# EAGLE design NodeLCD.v1 (EAGLE 4.13)
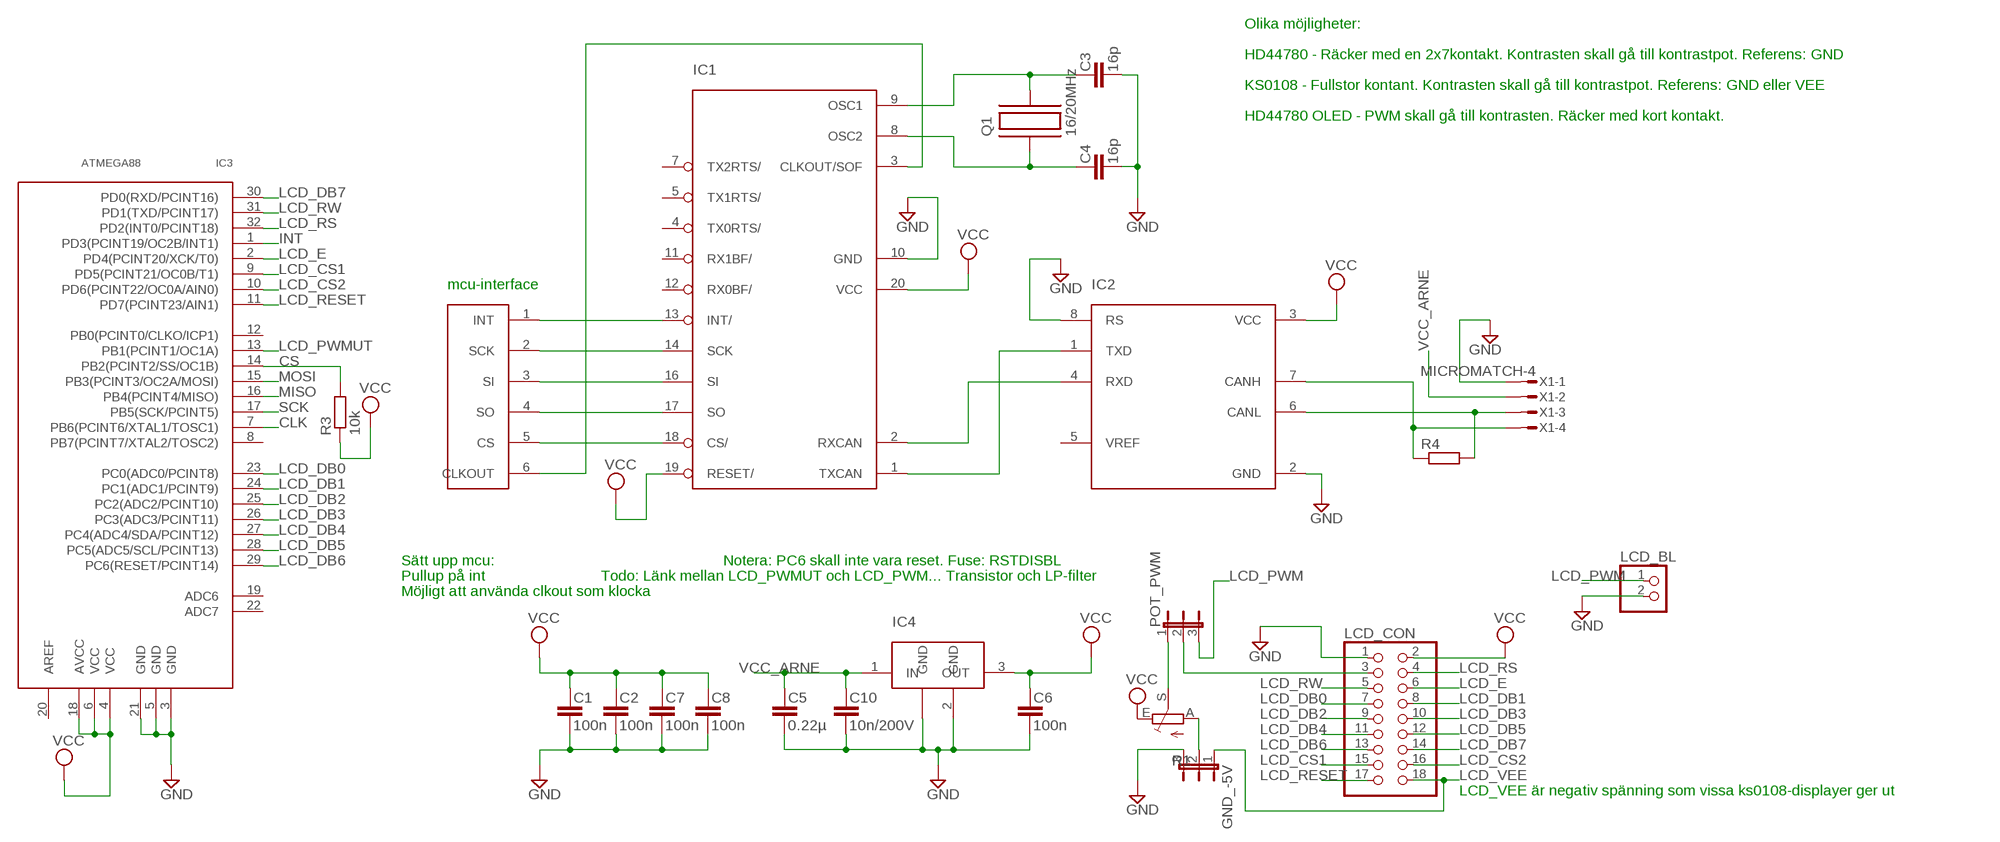
[diagram p0: schematic, sheet 1]

## Parts
C1  100n  C-EU  [C0603]
C2  100n  C-EU  [C0603]
C3  16p  C-EU  [C0603]
C4  16p  C-EU  [C0603]
C5  0.22µ  C-EU  [C0603]
C6  100n  C-EU  [C0603]
C7  100n  C-EU  [C0603]
C8  100n  C-EU  [C0603]
C10  10n/200V  C-EU  [C0603]
GND_-5V  JP2E  [JP2]
IC1  MCP2515  [TSSOP]
IC2  MCP2551  [SOIC]
IC3  ATMEGA88  [TQFP32]
IC4  LM340MP-5.0  [SOT223]
LCD_BL  PINHD-1X2  [1X02]
LCD_CON  PINHD-2X9  [2X09]
POT_PWM  JP2E  [JP2]
Q1  16/20MHz  C-MAC-LFA147E  [SMD]
R1  TRIM_EU-CA9H  [CA9H]
R3  10k  R-EUR0603  [R0603]
R4  R-EUR0603  [R0603]
U$1  CAN-INTERFACE  [VIA-LIST]
X1  MICROMATCH-4  [MICROMATCH-4]

## Nets
CANH: IC2.7(CANH) R4.1 X1.4
CANL: IC2.6(CANL) R4.2 X1.3
CLK: IC1.3(CLKOUT/SOF) IC3.7(PB6(PCINT6/XTAL1/TOSC1)) U$1.6(CLKOUT)
CS: IC1.18(CS/) IC3.14(PB2(PCINT2/SS/OC1B)) R3.2 U$1.5(CS)
GND: C1.2 C2.2 C3.2 C4.2 C5.2 C6.2 C7.2 C8.2 C10.2 GND_-5V.3 IC1.10(GND) IC2.2(GND) IC2.8(RS) IC3.3(GND) IC3.5(GND) IC3.21(GND) IC4.2(GND) IC4.4(GND) LCD_BL.2 LCD_CON.1 X1.1
INT: IC1.13(INT/) IC3.1(PD3(PCINT19/OC2B/INT1)) U$1.1(INT)
LCD_CS1: IC3.9(PD5(PCINT21/OC0B/T1)) LCD_CON.15
LCD_CS2: IC3.10(PD6(PCINT22/OC0A/AIN0)) LCD_CON.16
LCD_DB0: IC3.23(PC0(ADC0/PCINT8)) LCD_CON.7
LCD_DB1: IC3.24(PC1(ADC1/PCINT9)) LCD_CON.8
LCD_DB2: IC3.25(PC2(ADC2/PCINT10)) LCD_CON.9
LCD_DB3: IC3.26(PC3(ADC3/PCINT11)) LCD_CON.10
LCD_DB4: IC3.27(PC4(ADC4/SDA/PCINT12)) LCD_CON.11
LCD_DB5: IC3.28(PC5(ADC5/SCL/PCINT13)) LCD_CON.12
LCD_DB6: IC3.29(PC6(RESET/PCINT14)) LCD_CON.13
LCD_DB7: IC3.30(PD0(RXD/PCINT16)) LCD_CON.14
LCD_E: IC3.2(PD4(PCINT20/XCK/T0)) LCD_CON.6
LCD_PWM: LCD_BL.1 POT_PWM.3
LCD_PWMUT: IC3.13(PB1(PCINT1/OC1A))
LCD_RESET: IC3.11(PD7(PCINT23/AIN1)) LCD_CON.17
LCD_RS: IC3.32(PD2(INT0/PCINT18)) LCD_CON.4
LCD_RW: IC3.31(PD1(TXD/PCINT17)) LCD_CON.5
LCD_VEE: GND_-5V.1 LCD_CON.18
MISO: IC1.17(SO) IC3.16(PB4(PCINT4/MISO)) U$1.4(SO)
MOSI: IC1.16(SI) IC3.15(PB3(PCINT3/OC2A/MOSI)) U$1.3(SI)
N$1: IC1.2(RXCAN) IC2.4(RXD)
N$2: IC1.1(TXCAN) IC2.1(TXD)
N$3: POT_PWM.1 R1.S
N$4: GND_-5V.2 R1.A
N$5: LCD_CON.3 POT_PWM.2
N$12: C3.1 IC1.9(OSC1) Q1.P$2
N$13: C4.1 IC1.8(OSC2) Q1.P$1
SCK: IC1.14(SCK) IC3.17(PB5(SCK/PCINT5)) U$1.2(SCK)
VCC: C1.1 C2.1 C6.1 C7.1 C8.1 IC1.19(RESET/) IC1.20(VCC) IC2.3(VCC) IC3.4(VCC) IC3.6(VCC) IC3.18(AVCC) IC4.3(OUT) LCD_CON.2 R1.E R3.1
VCC_ARNE: C5.1 C10.1 IC4.1(IN) X1.2
Unconnected: IC1.4(TX0RTS/) IC1.5(TX1RTS/) IC1.7(TX2RTS/) IC1.11(RX1BF/) IC1.12(RX0BF/) IC2.5(VREF) IC3.8(PB7(PCINT7/XTAL2/TOSC2)) IC3.12(PB0(PCINT0/CLKO/ICP1)) IC3.19(ADC6) IC3.20(AREF) IC3.22(ADC7)

## Notes on the sheet
- Olika möjligheter:
- HD44780 - Räcker med en 2x7kontakt. Kontrasten skall gå till kontrastpot. Referens: GND
- KS0108 - Fullstor kontant. Kontrasten skall gå till kontrastpot. Referens: GND eller VEE
- HD44780 OLED - PWM skall gå till kontrasten. Räcker med kort kontakt.
- mcu-interface
- Sätt upp mcu: | Notera: PC6 skall inte vara reset. Fuse: RSTDISBL
- Pullup på int | Todo: Länk mellan LCD_PWMUT och LCD_PWM... Transistor och LP-filter
- Möjligt att använda clkout som klocka
- LCD_VEE är negativ spänning som vissa ks0108-displayer ger ut

## Library data of the parts
C1-C8 C10 = rcl:C-EU
GND_-5V POT_PWM = jumper:JP2E: JUMPER
IC1 = mcp2515:MCP2515
IC2 = mcp2551:MCP2551
IC3 = atmega88:ATMEGA88
IC4 = lm340mp:LM340MP-5.0
LCD_BL = pinhead:PINHD-1X2: PIN HEADER
LCD_CON = pinhead:PINHD-2X9: PIN HEADER
Q1 = hc49-4h-smx:C-MAC-LFA147E
R1 = pot:TRIM_EU-: POTENTIOMETER
R3 R4 = rcl:R-EU
U$1 = can-interface:CAN-INTERFACE
X1 = con-amp-micromatch:MICROMATCH-4: MicroMaTch 4 7-215464-4 / 0-215464-4 Drawing Number C-215464 DDEController.pdf

## Board
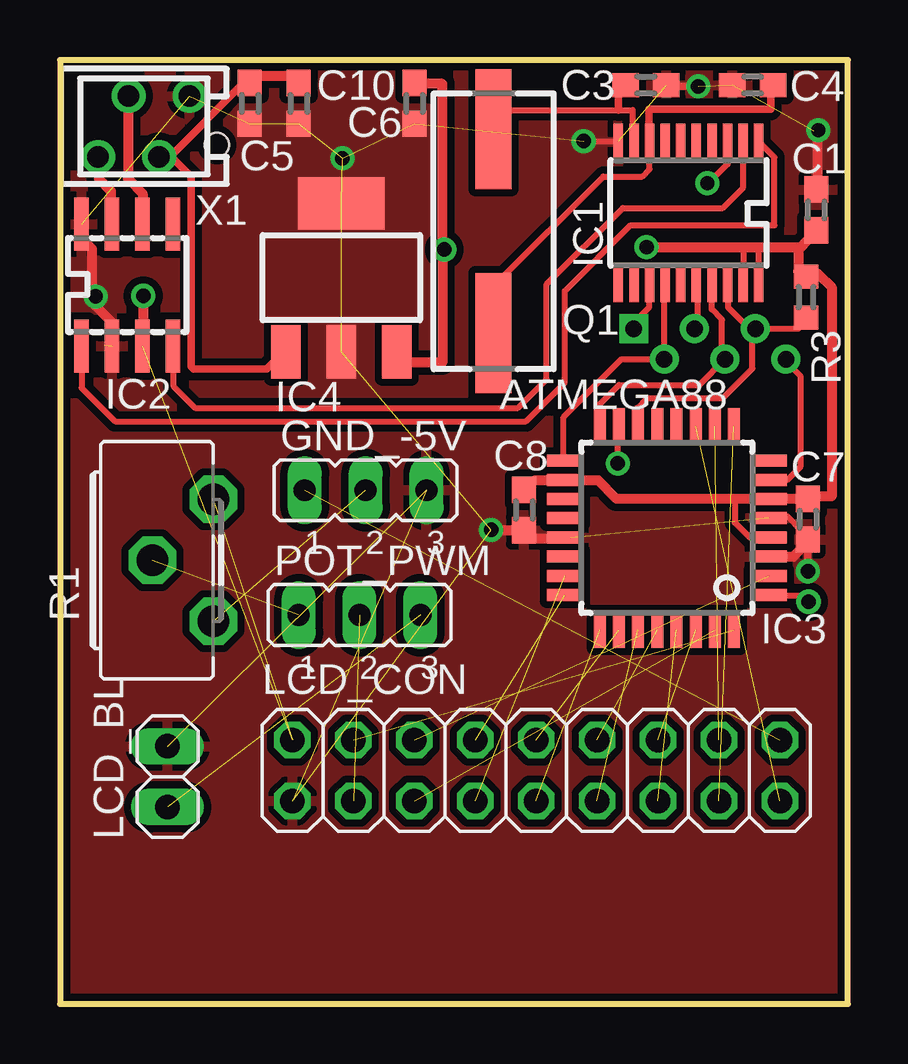
[diagram p1: board, top side]
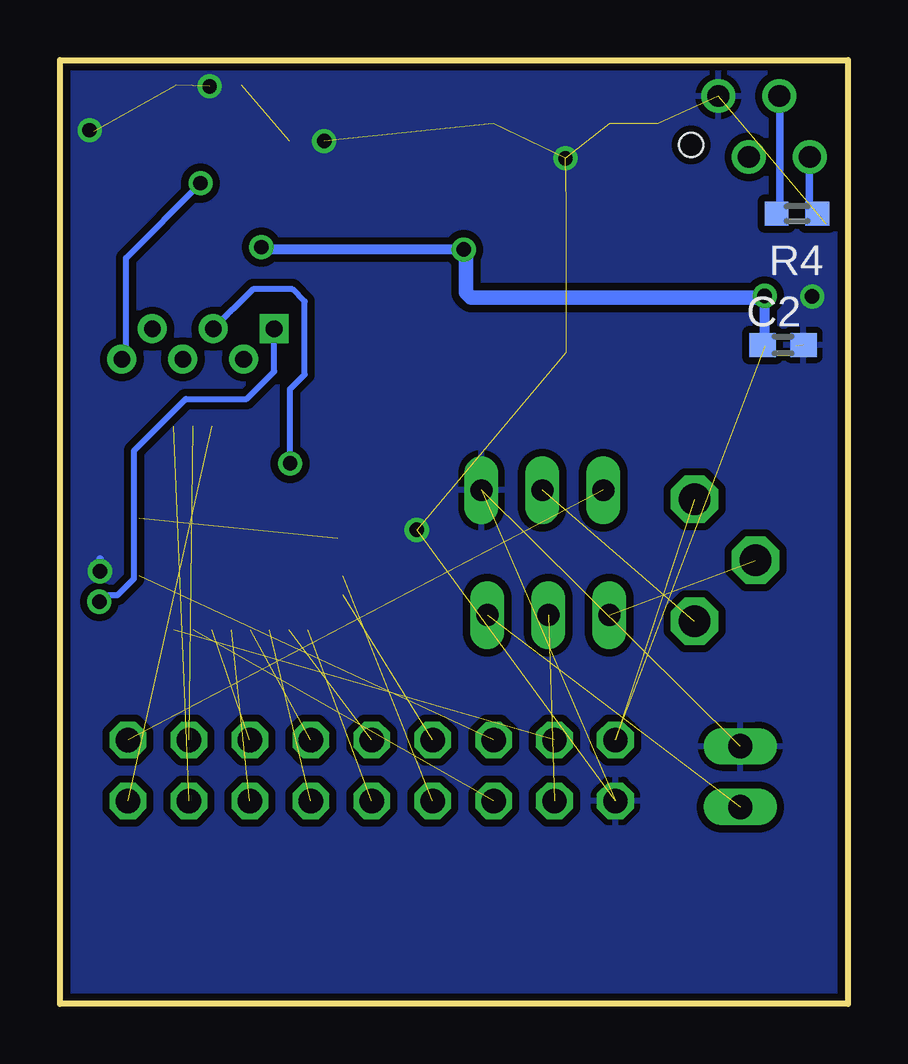
[diagram p2: board, bottom side, seen from below]

Size 32.85 x 39.35 mm. Coordinates in mm from the lower left corner, seen from the top.
Outline: 0,0 32.85,0 32.85,39.35 0,39.35 0,0
Copper layers (1*16): Top 0.035mm / dielectric 1.5mm / Bottom 0.035mm
Design rules "10mils, 0.6drill": minimum track width 10mil, minimum drill 0.6mm, track to track 10mil, track to pad 10mil, pad to pad 10mil, via to via 10mil, smd to smd 10mil, copper to edge 10mil, drill to drill 10mil, minimum pad ring 10mil, minimum via ring 8mil, stop-mask expansion 0mil, vias tented up to drill 0mil, thermal gap 10mil

### Footprints (pad centres in the part's own frame; a part is rotated, then mirrored left to right if it is on the bottom)
C0603 = smd 1.1 x 1: 1 -0.85,0; 2 0.85,0
JP2 = drill 0.914 long: 1 -2.54,0; 2 0,0; 3 2.54,0
TSSOP = smd 0.396 x 1.5: 1 -2.925,-2.975; 2 -2.275,-2.975; 3 -1.625,-2.975; 4 -0.975,-2.975; 5 -0.325,-2.975; 6 0.325,-2.975; 7 0.975,-2.975; 8 1.625,-2.975; 9 2.275,-2.975; 10 2.925,-2.975; 11 2.925,2.975; 12 2.275,2.975; 13 1.625,2.975; 14 0.975,2.975; 15 0.325,2.975; 16 -0.325,2.975; 17 -0.975,2.975; 18 -1.625,2.975; 19 -2.275,2.975; 20 -2.925,2.975
SOIC = smd 0.6 x 2.2: 1 -1.905,-2.54; 2 -0.635,-2.54; 3 0.635,-2.54; 4 1.905,-2.54; 5 1.905,2.54; 6 0.635,2.54; 7 -0.635,2.54; 8 -1.905,2.54
TQFP32 = smd 1.5 x 0.5: 1 -4.25,2.65; 2 -4.25,1.85; 3 -4.25,1.05; 4 -4.25,0.25; 5 -4.25,-0.55; 6 -4.25,-1.35; 7 -4.25,-2.15; 8 -4.25,-2.95; 17 4.25,-2.95; 18 4.25,-2.15; 19 4.25,-1.35; 20 4.25,-0.55; 21 4.25,0.25; 22 4.25,1.05; 23 4.25,1.85; 24 4.25,2.65 | smd 0.5 x 1.5: 9 -2.8,-4.4; 10 -2,-4.4; 11 -1.2,-4.4; 12 -0.4,-4.4; 13 0.4,-4.4; 14 1.2,-4.4; 15 2,-4.4; 16 2.8,-4.4; 25 2.8,4.1; 26 2,4.1; 27 1.2,4.1; 28 0.4,4.1; 29 -0.4,4.1; 30 -1.2,4.1; 31 -2,4.1; 32 -2.8,4.1
SOT223 = smd 1.219 x 2.235: 1 -2.311,-3.099; 2 0,-3.099; 3 2.311,-3.099 | smd 3.6 x 2.2: 4 0,3.099
1X02 = drill 1.016 long: 1 -1.27,0; 2 1.27,0
2X09 = drill 1.016 octagon: 1 -10.16,-1.27; 2 -10.16,1.27; 3 -7.62,-1.27; 4 -7.62,1.27; 5 -5.08,-1.27; 6 -5.08,1.27; 7 -2.54,-1.27; 8 -2.54,1.27; 9 0,-1.27; 10 0,1.27; 11 2.54,-1.27; 12 2.54,1.27; 13 5.08,-1.27; 14 5.08,1.27; 15 7.62,-1.27; 16 7.62,1.27; 17 10.16,-1.27; 18 10.16,1.27
SMD = smd 5 x 1.5: P$1 4.25,0; P$2 -4.25,0
CA9H = drill 1.321 octagon: A -2.54,0; E 2.54,0; S 0,2.54
R0603 = smd 0.991 x 1.016: 1 -0.85,0; 2 0.85,0
VIA-LIST = drill 0.7 square: 1 0,2.54 | drill 0.7 round: 2 -1.27,1.27; 3 0,0; 4 -1.27,-1.27; 5 0,-2.54; 6 -1.27,-3.81
MICROMATCH-4 = drill 0.9 round: 1 1.905,1.27; 2 0.635,-1.27; 3 -0.635,1.27; 4 -1.905,-1.27 | hole 1: 3.048,-0.762

### Placement (x,y rotation side)
C1  31.54,33.1 90 top
C2  2.7,27.47 0 bottom
C3  24.43,38.3 0 top
C4  28.87,38.3 180 top
C5  7.92,37.54 270 top
C6  14.77,37.54 270 top
C7  31.17,20.21 270 top
C8  19.34,20.59 270 top
C10  9.95,37.54 270 top
GND_-5V  12.74,21.41 0 top
IC1  26.21,32.97 180 top
IC2  2.8,29.97 0 top
IC3  25.3,19.7 180 top
IC4  11.73,30.27 0 top
LCD_BL  4.49,9.47 90 top
LCD_CON  19.85,9.73 0 top
POT_PWM  12.49,16.21 0 top
Q1  18.08,32.21 270 top
R1  6.39,18.49 90 top
R3  31.11,29.46 270 top
R4  2.12,32.94 180 bottom
U$1  26.46,28.14 90 top
X1  3.5,36.58 0 top

### Tracks (layer width: path | path; a pad name or v marks a point on that pad's centre or on a via)
CANH
  Top 0.305: 2.12,32.55 IC2.7 | X1.4 1.62,35.31
  Top 0.406: 2.12,32.55 2.12,33.88 1.62,34.39 1.62,35.31
  Bottom 0.305: X1.4 1.62,35.31 1.62,33.29 R4.1
CANL
  Top 0.305: IC2.6 | X1.3 2.84,37.85
  Top 0.406: IC2.6 3.45,33.78 2.84,34.39 2.84,37.85
  Bottom 0.305: X1.3 2.84,37.85 2.84,33.08 R4.2
CLK  (via drill 0.6)
  Top 0.254: IC1.3 27.83,35.84 27.83,35 27.02,34.19 v26.99,34.22 | IC3.7 30.32,21.85 30.88,22.4 30.88,26.16 30.22,26.82 30.17,26.87
  Top 0.406: 30.17,26.77 30.22,26.82 U$1.6
  Bottom 0.254: v26.99,34.22 30.09,31.09 30.09,27.03 U$1.6
CS
  Top 0.254: IC1.18 27.83,30.12 27.86,30.12 27.86,29.03 28.87,28.02 | IC3.14 24.07,24.23 | 24.07,24.23 24.07,24.25 | 28.87,28.02 28.87,26.49 27.63,25.25 24.48,25.25 24.07,24.84 24.07,24.44 24.17,23.72 24.07,24.23 | 28.87,28.02 U$1.5 30.78,28.14 31.03,28.4 31.03,28.6 30.97,28.6 R3.2
GND  (via drill 0.6)  (17 unrouted)
  Top 0.254: v21.84,35.97 23.28,35.97 IC1.10 | C1.2 31.59,34.27 | 1.34,29.24 v1.49,29.49 | 20.56,19.41 IC3.21 21.28,19.43 | C8.2 19.8,19.41 | C7.2 31.11,19.69 30.93,19.69 30.32,20.32 29.76,20.27 29.74,20.25 IC3.5 | v31.61,36.42 31.44,36.37 31.59,36.22
  Top 0.305: IC2.2 2.2,27.76 | C3.2 25.45,38.25 v26.61,38.25 | 30.93,19.69 31.16,19.69 31.18,19.66 31.18,19.15 v31.18,18.04
  Top 0.406: 2.2,27.76 2.2,28.37 1.34,29.24 1.34,31.47 0.83,31.98 IC2.8 | 19.8,19.41 20.56,19.41 | 31.59,34.27 31.59,36.22 | 31.18,19.15 31.08,19.15 30.58,18.65 IC3.3 | C8.2 18,19.74 v17.97,19.76
  Bottom 0.305: v26.61,38.25 26.56,38.33 | v31.18,18.04 31.18,18.54
  Bottom 0.406: v17.97,19.76 18.08,19.76
  other vias: 11.78,35.25
  pour Bottom (isolate 0.305): 0.12,39.24 32.83,39.24 32.83,0.1 24.38,0.1 0.12,0.1
  pour Top (isolate 0.305, no thermals): 5.83,38.88 15.89,38.88 15.89,25.16 5.83,25.16
  pour Top (isolate 0.305): 0.17,39.19 32.68,39.19 32.68,0.08 0.17,0.08
INT  (via drill 0.6)
  Top 0.254: IC1.13 | IC1.13 | U$1.1 23.92,28.4 24.55,29.03 24.55,29.97 IC1.13 | IC3.1 29.48,17.05 29.46,17.02 30.01,17.07 30.07,17.02 30.95,17.02 v31.21,16.77
  Bottom 0.254: v31.21,16.77 30.9,17.04 30.45,17.04 29.76,17.73 29.76,23.06 27.6,25.22 25.06,25.22 23.92,26.37 U$1.1
LCD_CS1  (1 unrouted)
LCD_CS2  (1 unrouted)
LCD_DB0  (1 unrouted)
LCD_DB1  (1 unrouted)
LCD_DB2  (1 unrouted)
LCD_DB3  (1 unrouted)
LCD_DB4  (1 unrouted)
LCD_DB5  (1 unrouted)
LCD_DB6  (1 unrouted)
LCD_DB7  (1 unrouted)
LCD_E  (1 unrouted)
LCD_PWM  (1 unrouted)
LCD_RESET  (1 unrouted)
LCD_RS  (1 unrouted)
LCD_RW  (1 unrouted)
LCD_VEE  (1 unrouted)
MISO
  Top 0.254: IC1.17 27.18,30.06 27.17,30.05 27.17,28.96 27.6,28.53 27.6,27.13 27.73,27 U$1.4 26.66,25.81 23.31,25.81 22.45,24.94 22.45,23.62 22.44,23.61 22.41,23.61 | IC3.16 22.41,23.61 | 22.41,23.61 22.39,23.69
MOSI  (via drill 0.6)
  Top 0.254: IC1.16 26.53,30.12 26.51,30.1 26.51,29.87 26.58,29.79 26.58,28.27 U$1.3 | IC3.15 23.3,24.07 23.26,24.03 v23.26,22.53
  Bottom 0.254: U$1.3 26.51,28.2 | U$1.3 26.41,28.09 | v23.26,22.53 23.26,25.63 22.65,26.24 22.65,29.29 23.16,29.79 24.81,29.79 U$1.3
N$1
  Top 0.254: 4.77,27.38 4.75,27.38 IC2.4 4.71,27.41 4.74,27.38 4.74,25.73 5.63,24.84 19.09,24.84 20.29,26.04 20.29,30 23.46,33.17 27.63,33.17 28.48,34.03 IC1.2
N$2
  Top 0.254: IC1.1 29.79,35.3 29.79,32.46 23.79,32.46 21.05,29.72 21.05,25.91 19.42,24.28 2.3,24.28 0.91,25.68 IC2.1 | IC2.1 0.91,27.48 | IC2.1
N$3  (1 unrouted)
N$4  (1 unrouted)
N$5  (1 unrouted)
N$12
  Top 0.254: IC1.9 23.87,36.3 23.87,37.26 23.28,37.26 18.13,37.26 Q1.P$2
  Top 0.305: C3.1 23.28,37.83 23.28,37.26
N$13
  Top 0.254: Q1.P$1 18.14,29.99 22.65,34.49 24.27,34.49 24.58,34.8 24.58,35.71 24.55,35.74 24.55,35.82
  Top 0.305: IC1.8 24.55,35.82 24.55,37.29 29.63,37.29 29.63,38.34 C4.1
SCK
  Top 0.254: IC1.14 25.23,30.09 25.19,30.05 IC1.14 25.19,30 U$1.2 23.41,26.87 21,24.46 21,22.58 IC3.17
VCC  (via drill 0.6)  (2 unrouted)
  Top 0.254: 29.81,21.06 IC3.6 29.05,21.06 | 21.28,21.82 IC3.18 | IC1.20 29.12,30.12 29.12,31.55 29.68,31.55 | IC1.19 28.48,30.06 28.49,30.05 28.49,31.55 28.49,31.57 | 30.57,31.6 30.78,31.6 30.9,31.57 | IC3.4 28.75,19.45 28.13,20.07 28.13,21.06
  Top 0.406: 15.95,31.45 15.95,26.74 14.08,26.74 14.08,27.43 IC4.3 | IC2.3 3.42,27.81 3.47,28.3 v3.47,29.52 | 15.95,31.45 15.95,38.36 14.83,38.36 14.77,38.3 C6.1 | v16.02,31.45 15.95,31.45 | v24.45,31.55 28.49,31.55 29.68,31.55 | 29.68,31.55 29.68,31.54 | IC3.18 20.56,21.82 19.8,21.82 C8.1 | 29.81,21.06 30.7,21.06 C7.1 31.41,21.16 32.17,21.16 32.17,29.87 31.61,30.43 30.88,30.43 | 21.28,21.82 22.45,21.82 23.21,21.06 28.13,21.06 29.05,21.06 | 29.68,31.55 30.78,31.55 | 30.78,31.55 30.9,31.55 30.9,31.57 C1.1 | 30.88,30.43 30.88,30.34 R3.1 | 30.88,30.43 30.78,30.53 30.78,31.55
  Bottom 0.254: C2.1 3.47,27.97
  Bottom 0.406: 3.47,27.97 3.47,29.44 v3.47,29.52 | v24.45,31.55 24.4,31.55 24.3,31.45 v16.02,31.45
  Bottom 0.61: 3.47,29.44 15.71,29.44 15.92,29.64 15.92,31.45 v16.02,31.45
VCC_ARNE
  Top 0.254: 7.88,38.36 C5.1
  Top 0.305: IC4.1 9.31,27.18 8.61,26.47 5.58,26.47 5.48,26.57 5.48,34.49 4.67,35.31 4.26,35.31 | 7.88,38.36 7.61,38.36 4.56,35.31 4.26,35.31 | 4.26,35.31 X1.2
  Top 0.406: C10.1 9.95,38.69 7.92,38.69 C5.1